# EAGLE design btm_minibord (EAGLE 6.3)
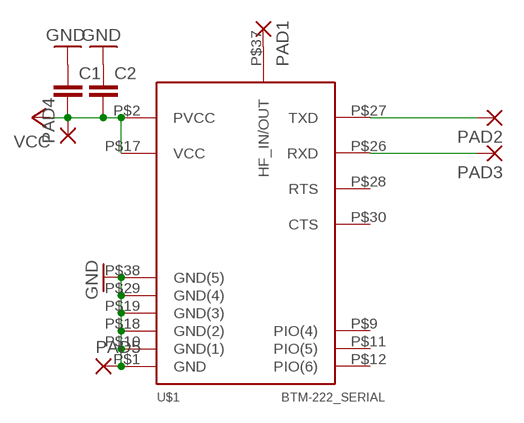
[diagram p0: schematic, sheet 1]

## Parts
C1  C-EUC0805  [C0805]
C2  C-EUC0805  [C0805]
PAD1  1,6/0,8  [1,6/0,8]
PAD2  1,6/0,8  [1,6/0,8]
PAD3  1,6/0,8  [1,6/0,8]
PAD4  1,6/0,8  [1,6/0,8]
PAD5  1,6/0,8  [1,6/0,8]
U$1  BTM-222_SERIAL  [BTM-222]

## Nets
GND: C1.1 C2.1 PAD5.1(P) U$1.P$1(GND) U$1.P$10(GND(1)) U$1.P$18(GND(2)) U$1.P$19(GND(3)) U$1.P$29(GND(4)) U$1.P$38(GND(5))
N$2: PAD2.1(P) U$1.P$27(TXD)
N$3: PAD3.1(P) U$1.P$26(RXD)
N$4: PAD1.1(P) U$1.P$37(HF_IN/OUT)
VCC: C1.2 C2.2 PAD4.1(P) U$1.P$2(PVCC) U$1.P$17(VCC)
Unconnected: U$1.P$9(PIO(4)) U$1.P$11(PIO(5)) U$1.P$12(PIO(6)) U$1.P$28(RTS) U$1.P$30(CTS)

## Library data of the parts
C1 C2 = rcl:C-EU: CAPACITOR, European symbol
PAD1-PAD5 = wirepad:1,6/0,8: THROUGH-HOLE PAD
U$1 = BTM_222:BTM-222_SERIAL

## Net classes
0 default: clearance 0.7 mm

## Board
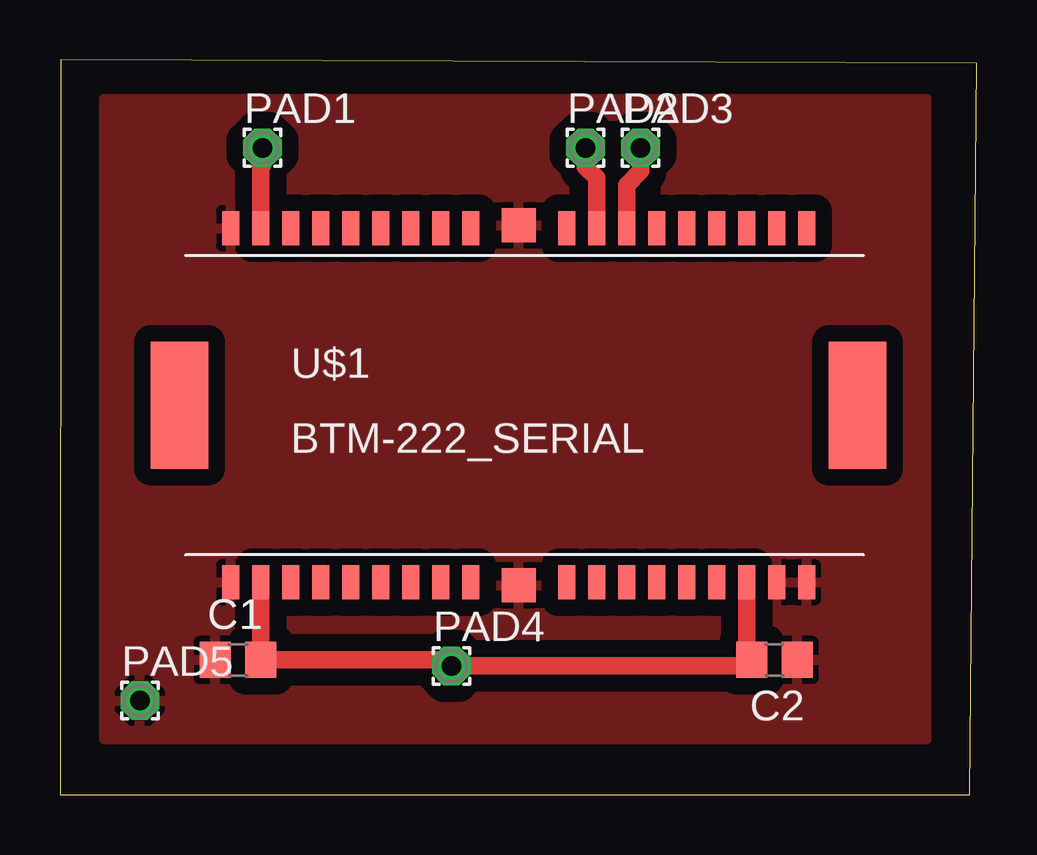
[diagram p1: board, top side]

Size 38.21 x 30.61 mm. Coordinates in mm from the lower left corner, seen from the top.
Outline: 0,0 37.9,0 38.21,30.48 0.03,30.61 0,0
Copper layers (1*16): Top 0.035mm / dielectric 1.5mm / Bottom 0.035mm
Design rules "default": minimum track width 10mil, minimum drill 24mil, track to track 8mil, track to pad 8mil, pad to pad 8mil, via to via 8mil, smd to smd 8mil, copper to edge 40mil, drill to drill 8mil, minimum pad ring 10mil, minimum via ring 8mil, stop-mask expansion 4mil, vias tented up to drill 0mil, thermal gap 10mil

### Footprints (pad centres in the part's own frame; a part is rotated, then mirrored left to right if it is on the bottom)
C0805 = smd 1.3 x 1.5: 1 -0.95,0; 2 0.95,0
1,6/0,8 = drill 0.813 pad 1.6 octagon: 1 0,0
BTM-222 = smd 2.4 x 5.3: $AGND -14.625,3.75; $BGND 13.625,3.75 | smd 0.711 x 1.422: P$1 -12.5,-3.625; P$2 -11.25,-3.625; P$3 -10,-3.625; P$4 -8.75,-3.625; P$5 -7.5,-3.625; P$6 -6.25,-3.625; P$7 -5,-3.625; P$8 -3.75,-3.625; P$9 -2.5,-3.625; P$11 1.5,-3.625; P$12 2.75,-3.625; P$13 4,-3.625; P$14 5.25,-3.625; P$15 6.5,-3.625; P$16 7.75,-3.625; P$17 9,-3.625; P$18 10.25,-3.625; P$19 11.5,-3.625; P$20 11.5,11.125; P$21 10.25,11.125; P$22 9,11.125; P$23 7.75,11.125; P$24 6.5,11.125; P$25 5.25,11.125; P$26 4,11.125; P$27 2.75,11.125; P$28 1.5,11.125; P$30 -2.5,11.125; P$31 -3.75,11.125; P$32 -5,11.125; P$33 -6.25,11.125; P$34 -7.5,11.125; P$35 -8.75,11.125; P$36 -10,11.125; P$37 -11.25,11.125; P$38 -12.5,11.125 | smd 1.422 x 1.4: P$10 -0.5,-3.75; P$29 -0.5,11.25

### Placement (x,y rotation side)
C1  7.42,5.61 0 top
C2  29.77,5.61 180 top
PAD1  8.43,26.95 0 top
PAD2  21.89,26.95 0 top
PAD3  24.18,26.95 0 top
PAD4  16.31,5.36 0 top
PAD5  3.33,3.91 0 top
U$1  19.61,12.47 0 top

### Tracks (layer width: path | path; a pad name or v marks a point on that pad's centre or on a via)
GND
  pour Top: 1.83,2.31 36.12,2.31 36.12,28.98 1.83,28.98
N$2
  Top 0.737: U$1.P$27 22.36,25.7 21.89,26.16 PAD2.1
N$3
  Top 0.737: U$1.P$26 23.61,25.39 24.21,25.98 24.21,26.92 PAD3.1
N$4
  Top 0.737: U$1.P$37 8.36,26.19 8.43,26.19 PAD1.1
VCC
  Top 0.737: U$1.P$2 C1.2 16.05,5.61 PAD4.1 28.56,5.36 C2.2 28.61,5.82 U$1.P$17